# EAGLE design play (EAGLE 7.5.0)
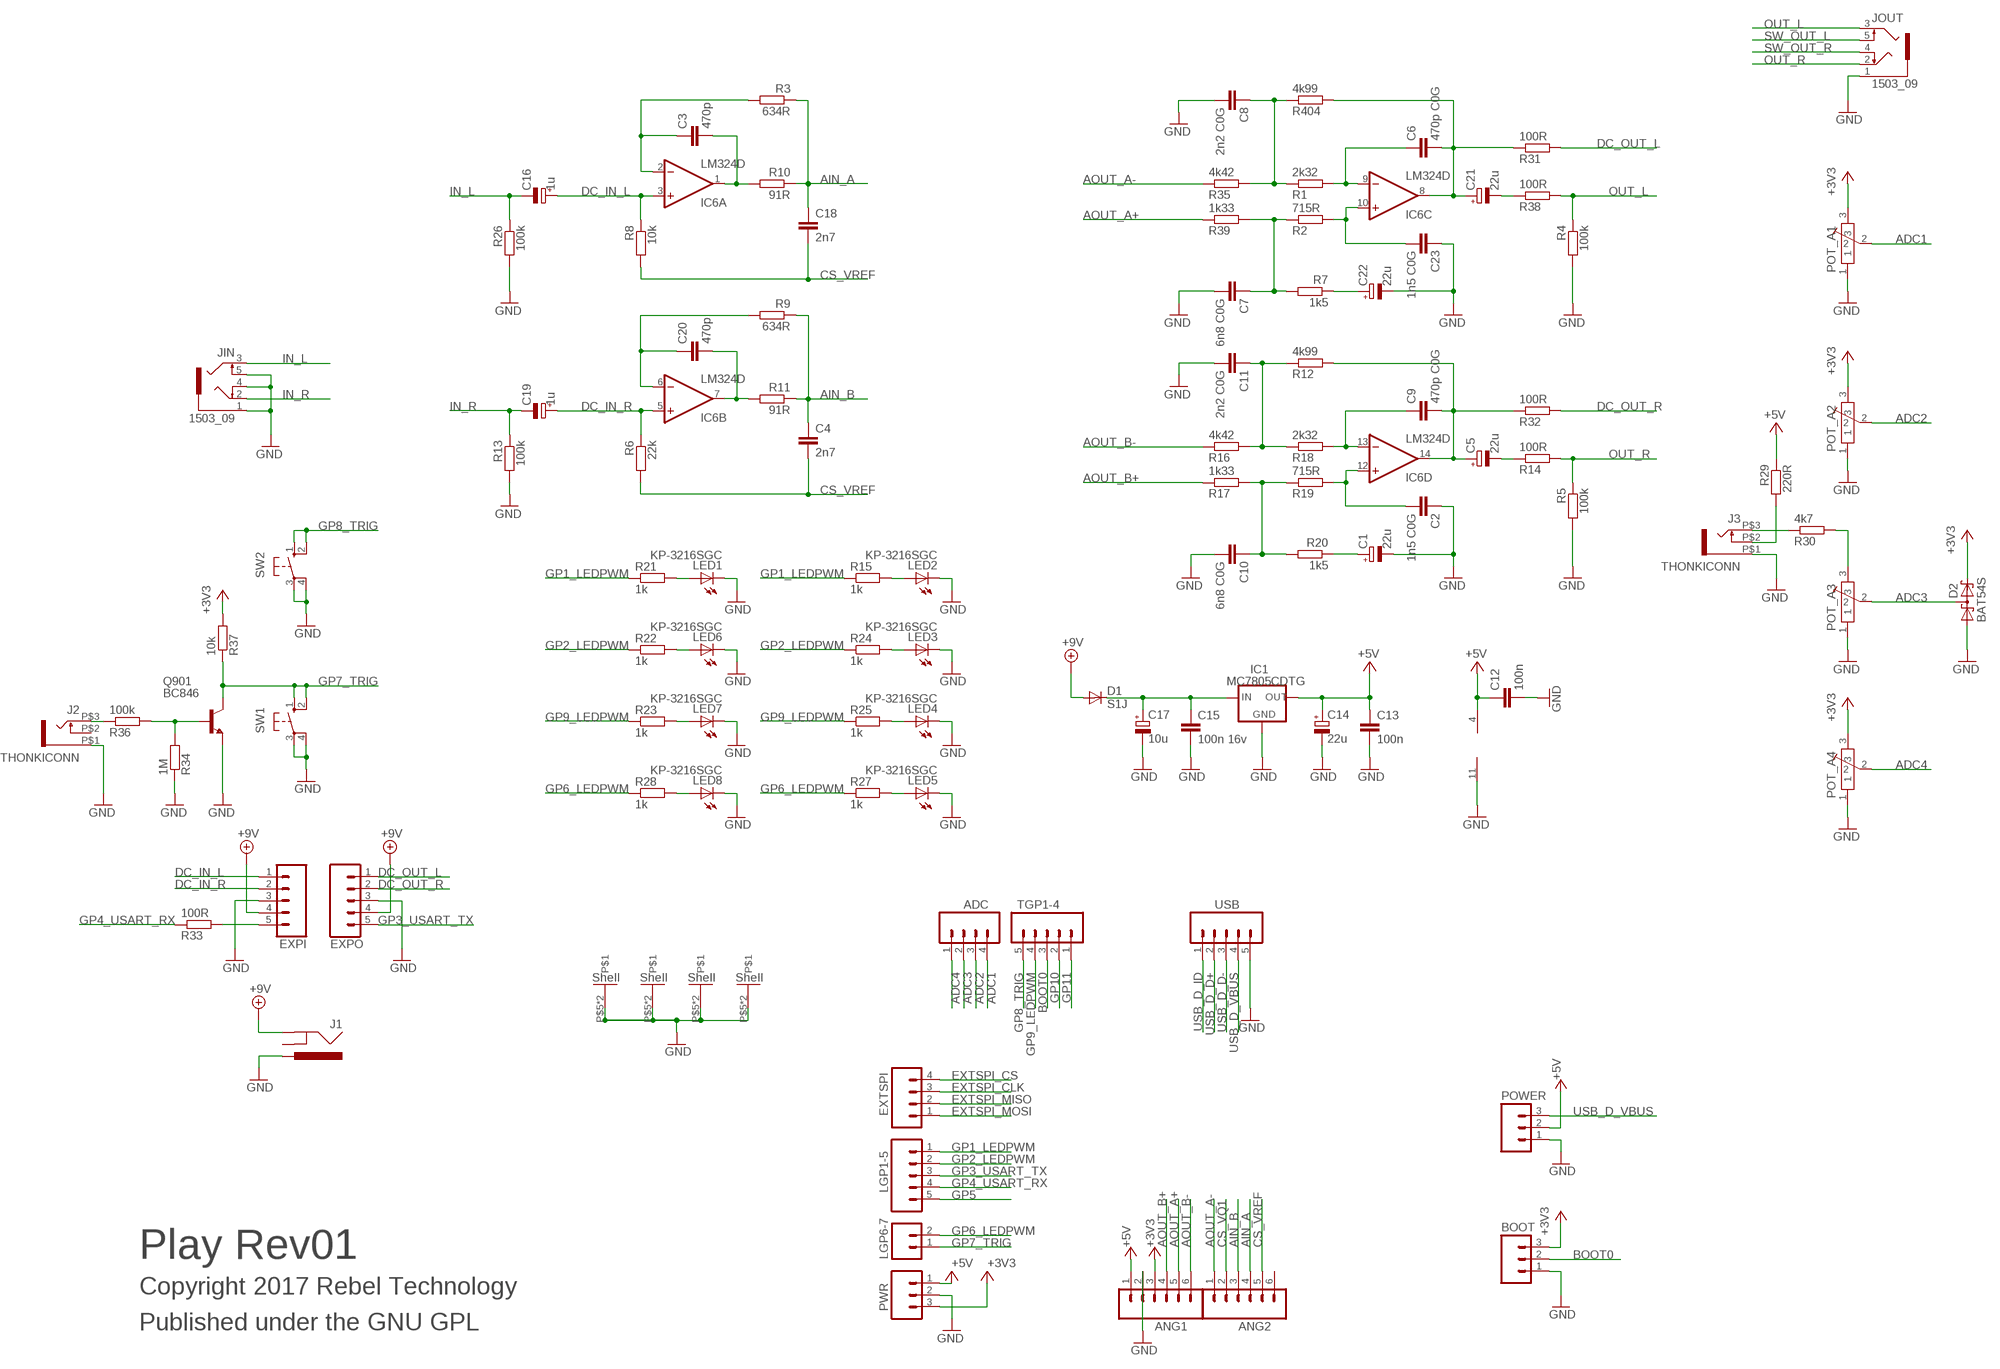
[diagram p0: schematic, sheet 1]

## Parts
ADC  M04PTH  [1X04]
ANG1  M06SIP  [1X06]
ANG2  M06SIP  [1X06]
BOOT  M03PTH  [1X03]
C1  22u  CPOL-EU153CLV-0505  [CPOL-5]
C2  1n5 C0G  C-EUC0603  [C0603]
C3  470p  C-EUC0603  [C0603]
C4  2n7  C-EUC0603  [C0603]
C5  22u  CPOL-EU153CLV-0505  [CPOL-5]
C6  470p C0G  C-EUC0603  [C0603]
C7  6n8 C0G  C-EUC0603  [C0603]
C8  2n2 C0G  C-EUC0603  [C0603]
C9  470p C0G  C-EUC0603  [C0603]
C10  6n8 C0G  C-EUC0603  [C0603]
C11  2n2 C0G  C-EUC0603  [C0603]
C12  100n  C-EUC0603  [C0603]
C13  100n  C-EUC0603  [C0603]
C14  22u  CPOL-EU153CLV-0505  [CPOL-5]
C15  100n 16v  C-EUC0603  [C0603]
C16  1u  CPOL-EU153CLV-0405  [153CLV-0405]
C17  10u  CPOL-EU153CLV-0405  [153CLV-0405]
C18  2n7  C-EUC0603  [C0603]
C19  1u  CPOL-EU153CLV-0405  [153CLV-0405]
C20  470p  C-EUC0603  [C0603]
C21  22u  CPOL-EU153CLV-0505  [CPOL-5]
C22  22u  CPOL-EU153CLV-0505  [CPOL-5]
C23  1n5 C0G  C-EUC0603  [C0603]
D1  S1J  DIODESMA  [SMA-DIODE]
D2  BAT54S  [SOT23]
EXPI  M05PTH  [1X05]
EXPO  M05PTH  [1X05]
EXTSPI  M04PTH  [1X04]
IC1  MC7805CDTG  MC78XX  [DPACK]
IC6  LM324D  [SO14]
J1  POWER_JACKPTH  [POWER_JACK_PTH]
J2  THONKICONN  [THONKICONN]
J3  THONKICONN  [THONKICONN]
JIN  1503_09  [1503_09]
JOUT  1503_09  [1503_09]
LED1  KP-3216SGC  LED1206  [LED-1206]
LED2  KP-3216SGC  LED1206  [LED-1206]
LED3  KP-3216SGC  LED1206  [LED-1206]
LED4  KP-3216SGC  LED1206  [LED-1206]
LED5  KP-3216SGC  LED1206  [LED-1206]
LED6  KP-3216SGC  LED1206  [LED-1206]
LED7  KP-3216SGC  LED1206  [LED-1206]
LED8  KP-3216SGC  LED1206  [LED-1206]
LGP1-5  M05PTH  [1X05]
LGP6-7  M02PTH  [1X02]
POT_A1  POT-ALPS-RK09L1140  [POT-ALPS-RK09L1140]
POT_A2  POT-ALPS-RK09L1140  [POT-ALPS-RK09L1140]
POT_A3  POT-ALPS-RK09L1140  [POT-ALPS-RK09L1140]
POT_A4  POT-ALPS-RK09L1140  [POT-ALPS-RK09L1140]
POWER  M03PTH  [1X03]
PWR  M03PTH  [1X03]
Q901  BC846  [SOT23]
R1  2k32  R-EU_0603  [0603]
R2  715R  R-EU_0603  [0603]
R3  634R  R-EU_0603  [0603]
R4  100k  R-EU_0603  [0603]
R5  100k  R-EU_0603  [0603]
R6  22k  R-EU_0603  [0603]
R7  1k5  R-EU_0603  [0603]
R8  10k  R-EU_0603  [0603]
R9  634R  R-EU_0603  [0603]
R10  91R  R-EU_0603  [0603]
R11  91R  R-EU_0603  [0603]
R12  4k99  R-EU_0603  [0603]
R13  100k  R-EU_0603  [0603]
R14  100R  R-EU_0603  [0603]
R15  1k  R-EU_0603  [0603]
R16  4k42  R-EU_0603  [0603]
R17  1k33  R-EU_0603  [0603]
R18  2k32  R-EU_0603  [0603]
R19  715R  R-EU_0603  [0603]
R20  1k5  R-EU_0603  [0603]
R21  1k  R-EU_0603  [0603]
R22  1k  R-EU_0603  [0603]
R23  1k  R-EU_0603  [0603]
R24  1k  R-EU_0603  [0603]
R25  1k  R-EU_0603  [0603]
R26  100k  R-EU_0603  [0603]
R27  1k  R-EU_0603  [0603]
R28  1k  R-EU_0603  [0603]
R29  220R  R-EU_0603  [0603]
R30  4k7  R-EU_0603  [0603]
R31  100R  R-EU_0603  [0603]
R32  100R  R-EU_0603  [0603]
R33  100R  R-EU_0603  [0603]
R34  1M  R-EU_0603  [0603]
R35  4k42  R-EU_0603  [0603]
R36  100k  R-EU_0603  [0603]
R37  10k  R-EU_0603  [0603]
R38  100R  R-EU_0603  [0603]
R39  1k33  R-EU_0603  [0603]
R404  4k99  R-EU_0603  [0603]
SW1  10-XX  [B3F-10XX]
SW2  10-XX  [B3F-10XX]
TGP1-4  M05PTH  [1X05]
USB  M05PTH  [1X05]

## Nets
+3V3: ANG1.3 BOOT.3 D2.2(C2) POT_A1.3 POT_A2.3 POT_A4.3 PWR.3 R37.2
+5V: ANG1.1 C12.1 C13.1 C14.+ IC1.3(OUT) IC6.4(P:V+) POWER.2 PWR.1 R29.1
+9V: D1.A EXPI.4 EXPO.4 J1.GND
ADC1: ADC.4 POT_A1.2
ADC2: ADC.3 POT_A2.2
ADC3: ADC.2 D2.3(C1A2) POT_A3.2
ADC4: ADC.1 POT_A4.2
AIN_A: ANG2.4 C18.1 R3.1 R10.1
AIN_B: ANG2.3 C4.1 R9.1 R11.1
AOUT_A+: ANG1.5 R39.1
AOUT_A-: ANG2.1 R35.1
AOUT_B+: ANG1.4 R17.1
AOUT_B-: ANG1.6 R16.1
BOOT0: BOOT.2 TGP1-4.3
CS_VQ1: ANG2.2
CS_VREF: ANG2.5 C4.2 C18.2 R6.2 R8.2
DC_IN_L: C16.+ EXPI.1 IC6.3(A:+IN) R8.1
DC_IN_R: C19.+ EXPI.2 IC6.5(B:+IN) R6.1
DC_OUT_L: EXPO.1 R31.2
DC_OUT_R: EXPO.2 R32.2
EXTSPI_CLK: EXTSPI.3
EXTSPI_CS: EXTSPI.4
EXTSPI_MISO: EXTSPI.2
EXTSPI_MOSI: EXTSPI.1
GND: ANG1.2 BOOT.1 C1.- C2.1 C7.2 C8.2 C10.2 C11.2 C12.2 C13.2 C14.- C15.2 C17.- C22.- C23.1 D2.1(A1) EXPI.3 EXPO.3 IC1.4(GND) IC6.11(P:V-) J1.PWR J2.P$1 J3.P$1 JIN.1 JIN.4 JIN.5 JOUT.1 LED1.C LED2.C LED3.C LED4.C LED5.C LED6.C LED7.C LED8.C POT_A1.1 POT_A1.P$5 POT_A1.P$6 POT_A2.1 POT_A2.P$5 POT_A2.P$6 POT_A3.1 POT_A3.P$5 POT_A3.P$6 POT_A4.1 POT_A4.P$5 POT_A4.P$6 POWER.1 PWR.2 Q901.2(E) R4.2 R5.2 R13.2 R26.2 R34.1 SW1.3(P) SW1.4(P1) SW2.3(P) SW2.4(P1) USB.5
GP1_LEDPWM: LGP1-5.1 R15.1 R21.1
GP2_LEDPWM: LGP1-5.2 R22.1 R24.1
GP3_USART_TX: EXPO.5 LGP1-5.3
GP4_USART_RX: LGP1-5.4 R33.1
GP5: LGP1-5.5
GP6_LEDPWM: LGP6-7.2 R27.1 R28.1
GP7_TRIG: LGP6-7.1 Q901.3(C) R37.1 SW1.1(S) SW1.2(S1)
GP8_TRIG: SW2.1(S) SW2.2(S1) TGP1-4.5
GP9_LEDPWM: R23.1 R25.1 TGP1-4.4
GP10: TGP1-4.2
GP11: TGP1-4.1
IN_L: C16.- JIN.3 R26.1
IN_R: C19.- JIN.2 R13.1
N$1: EXPI.5 R33.2
N$3: C3.1 IC6.2(A:-IN) R3.2
N$4: C20.2 IC6.7(B:OUT) R11.2
N$5: C20.1 IC6.6(B:-IN) R9.2
N$6: C3.2 IC6.1(A:OUT) R10.2
N$7: C6.1 IC6.9(C:-IN) R1.2
N$8: C1.+ R20.1
N$9: C21.- R38.1
N$10: C22.+ R7.1
N$11: C23.2 IC6.10(C:+IN) R2.2
N$12: C5.+ C9.2 IC6.14(D:OUT) R12.2 R32.1
N$13: C5.- R14.1
N$14: LED2.A R15.2
N$15: C7.1 R2.1 R7.2 R39.2
N$16: LED1.A R21.2
N$17: LED6.A R22.2
N$18: LED7.A R23.2
N$19: LED8.A R28.2
N$20: LED3.A R24.2
N$21: LED4.A R25.2
N$22: J2.P$3 R36.1
N$23: J3.P$2 R29.2
N$24: C11.1 R12.1 R16.2 R18.1
N$25: POT_A3.3 R30.2
N$26: C9.1 IC6.13(D:-IN) R18.2
N$27: J3.P$3 R30.1
N$28: LED5.A R27.2
N$29: C15.1 C17.+ D1.C IC1.1(IN)
N$30: C2.2 IC6.12(D:+IN) R19.2
N$32: C10.1 R17.2 R19.1 R20.2
N$37: Q901.1(B) R34.2 R36.2
N$39: C6.2 C21.+ IC6.8(C:OUT) R31.1 R404.2
N$41: C8.1 R1.1 R35.2 R404.1
OUT_L: JOUT.3 R4.1 R38.2
OUT_R: JOUT.2 R5.1 R14.2
SW_OUT_L: JOUT.5
SW_OUT_R: JOUT.4
USB_D_D+: USB.2
USB_D_D-: USB.3
USB_D_ID: USB.1
USB_D_VBUS: POWER.3 USB.4
Unconnected: ANG2.6 J1.GNDBREAK J2.P$2

## Notes on the sheet
- Play Rev01
- Copyright 2017 Rebel Technology
- Published under the GNU GPL

## Library data of the parts
ADC EXTSPI = SparkFun:M04: Header 4 Standard 4-pin 0.1" header. Use with straight break away headers (SKU : PRT-00116), right angle break away headers (PRT-00553), swiss pins (PRT-00743), machine pins (PRT-00117), and female headers (PRT-00115). Molex polarized connector foot print use with SKU : PRT-08231 with associated crimp pins and housings. 1MM SMD Version SKU: PRT-10208
ANG1 ANG2 = SparkFun:M06: Header 6 Standard 6-pin 0.1" header. Use with straight break away headers (SKU : PRT-00116), right angle break away headers (PRT-00553), swiss pins (PRT-00743), machine pins (PRT-00117), and female headers (PRT-00115). Molex polarized connector foot print use with SKU : PRT-08094 with associated crimp pins and housings. NOTES ON THE VARIANTS LOCK and LOCK_LONGPADS... This footprint was designed to help hold the alignment of a through-hole component (i.e. 6-pin header) while soldering it into place. You may notice that each hole has been shifted either up or down by 0.005 of an inch from it's more standard position (which is a perfectly straight line). This slight alteration caused the pins (the squares in the middle) to touch the edges of the holes. Because they are alternating, it causes a "brace" to hold the component in place. 0.005 has proven to be the perfect amount of "off-center" position when using our standard breakaway headers. Although looks a little odd when you look at the bare footprint, once you have a header in there, the alteration is very hard to notice. Also, if you push a header all the way into place, it is covered up entirely on the bottom side. This idea of altering the position of holes to aid alignment will be further integrated into the Sparkfun Library for other footprints. It can help hold any component with 3 or more connection pins.
BOOT POWER PWR = SparkFun:M03: Header 3 Standard 3-pin 0.1" header. Use with straight break away headers (SKU : PRT-00116), right angle break away headers (PRT-00553), swiss pins (PRT-00743), machine pins (PRT-00117), and female headers (PRT-00115). Molex polarized connector foot print use with SKU : PRT-08232 with associated crimp pins and housings.
C1 C5 C14 C16 C17 C19 C21 C22 = Rebel:CPOL-EU: POLARIZED CAPACITOR, European symbol
C2-C4 C6-C12 C18 C20 C23 = resistor:C-EU: CAPACITOR, European symbol
C13 C15 = Rebel:C-EU: CAPACITOR, European symbol
D1 = SparkFun:DIODE: Diode These are standard reverse protection diodes and small signal diodes. SMA package can handle up to about 1A. SOD-323 can handle about 200mA. What the SOD-323 package when ordering, there are some mfgs out there that are 5-pin packages.
D2 = diode:BAT54S: Schottky Diodes Pin connection corrected 2011-05-04 Source: Fairchild .. BAT54.pdf
EXPI EXPO LGP1-5 TGP1-4 USB = SparkFun:M05: Header 5 Standard 5-pin 0.1" header. Use with straight break away headers (SKU : PRT-00116), right angle break away headers (PRT-00553), swiss pins (PRT-00743), machine pins (PRT-00117), and female headers (PRT-00115). Molex polarized connector foot print use with SKU : PRT-08230 with associated crimp pins and housings.
IC1 = James:MC78XX: VOLTAGE REGULATOR; OC_FARNELL: 2296028
IC6 = linear:LM324: OP AMP
J1 = SparkFun:POWER_JACK: Power Jack This is the standard 5.5mm barrel jack for power. The PTH is the most common, proven, reliable, footprint. All others are experimental. The Slot footprint only works if the mill layer is transmitted to the PCB fab house so be warned. Spark Fun Electronics SKU : PRT-00119. Mating wall wart : TOL-00298 (and others)
J2 J3 = Rebel:THONKICONN
JIN JOUT = con-lumberg:1503_09: Jack connectors according to JISC 6560, 3.5 mm Klinkeneinbaukupplung nach JISC 6560, 3,5 mm, 3-polig/ stereo, abgewinkelte Ausführung, mit 2 Öffnern und Lötaugen, für Leiterplatten Rückseitenmontage Source: http://www.lumberg.com/Produkte/PDFs/1503_09.pdf; OC_FARNELL: 1243244; OC_NEWARK: unknown
LED1-LED8 = SparkFun:LED: LEDs Standard schematic elements and footprints for 5mm, 3mm, 1206, and 0603 sized LEDs. 5mm - Spark Fun Electronics SKU : COM-00529 (and others); FARNELL: 853-0033
LGP6-7 = SparkFun:M02: Header 2 Standard 2-pin 0.1" header. Use with straight break away headers (SKU : PRT-00116), right angle break away headers (PRT-00553), swiss pins (PRT-00743), machine pins (PRT-00117), and female headers (PRT-00115). Molex polarized connector foot print use with SKU : PRT-08233 with associated crimp pins and housings.
POT_A1-POT_A4 = Rebel:POT-ALPS-RK09L
Q901 = transistor:BC846: NPN TRANSISTOR
R1-R39 R404 = Rebel:R-EU_: RESISTOR, European symbol
SW1 SW2 = switch-omron:10-XX: OMRON SWITCH; MPN: B3F-1000; OC_FARNELL: 176432; OC_NEWARK: 36M3542

## Net classes
1 power: width 0.178 mm, drill 0.305 mm, clearance 0.178 mm to class 0, clearance 0.178 mm

## Board
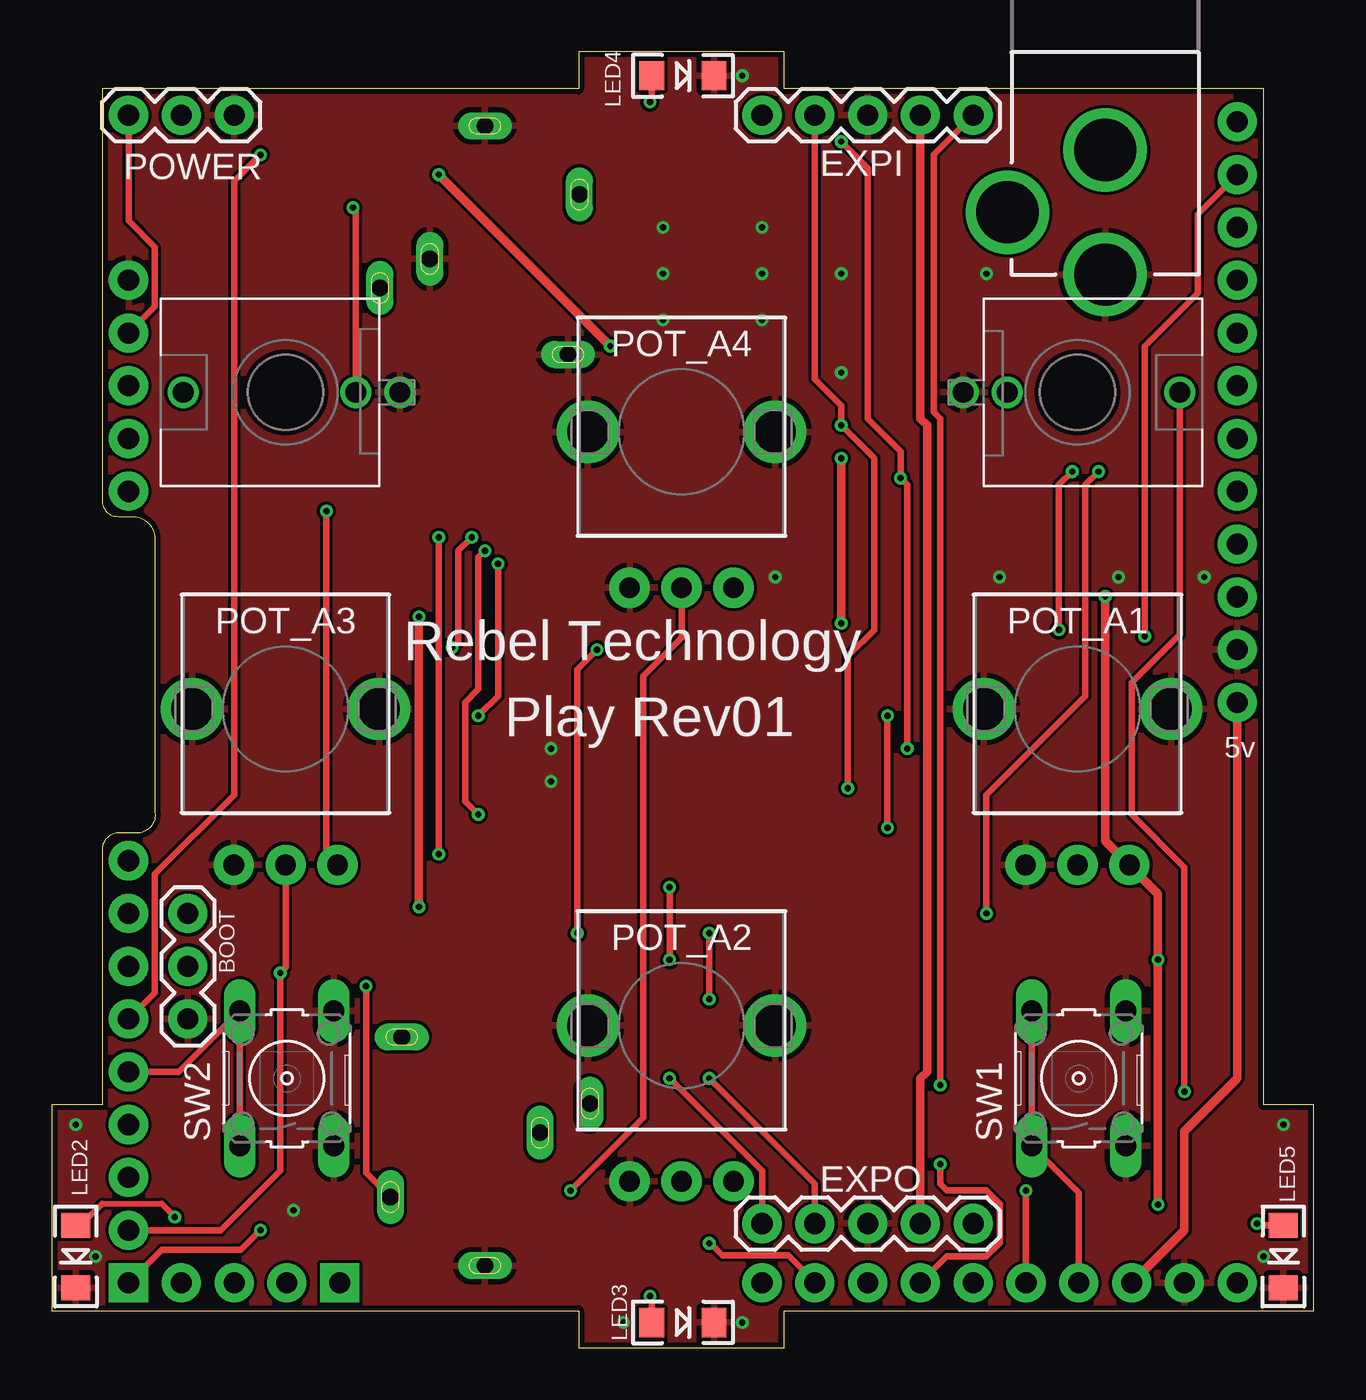
[diagram p1: board, top side]
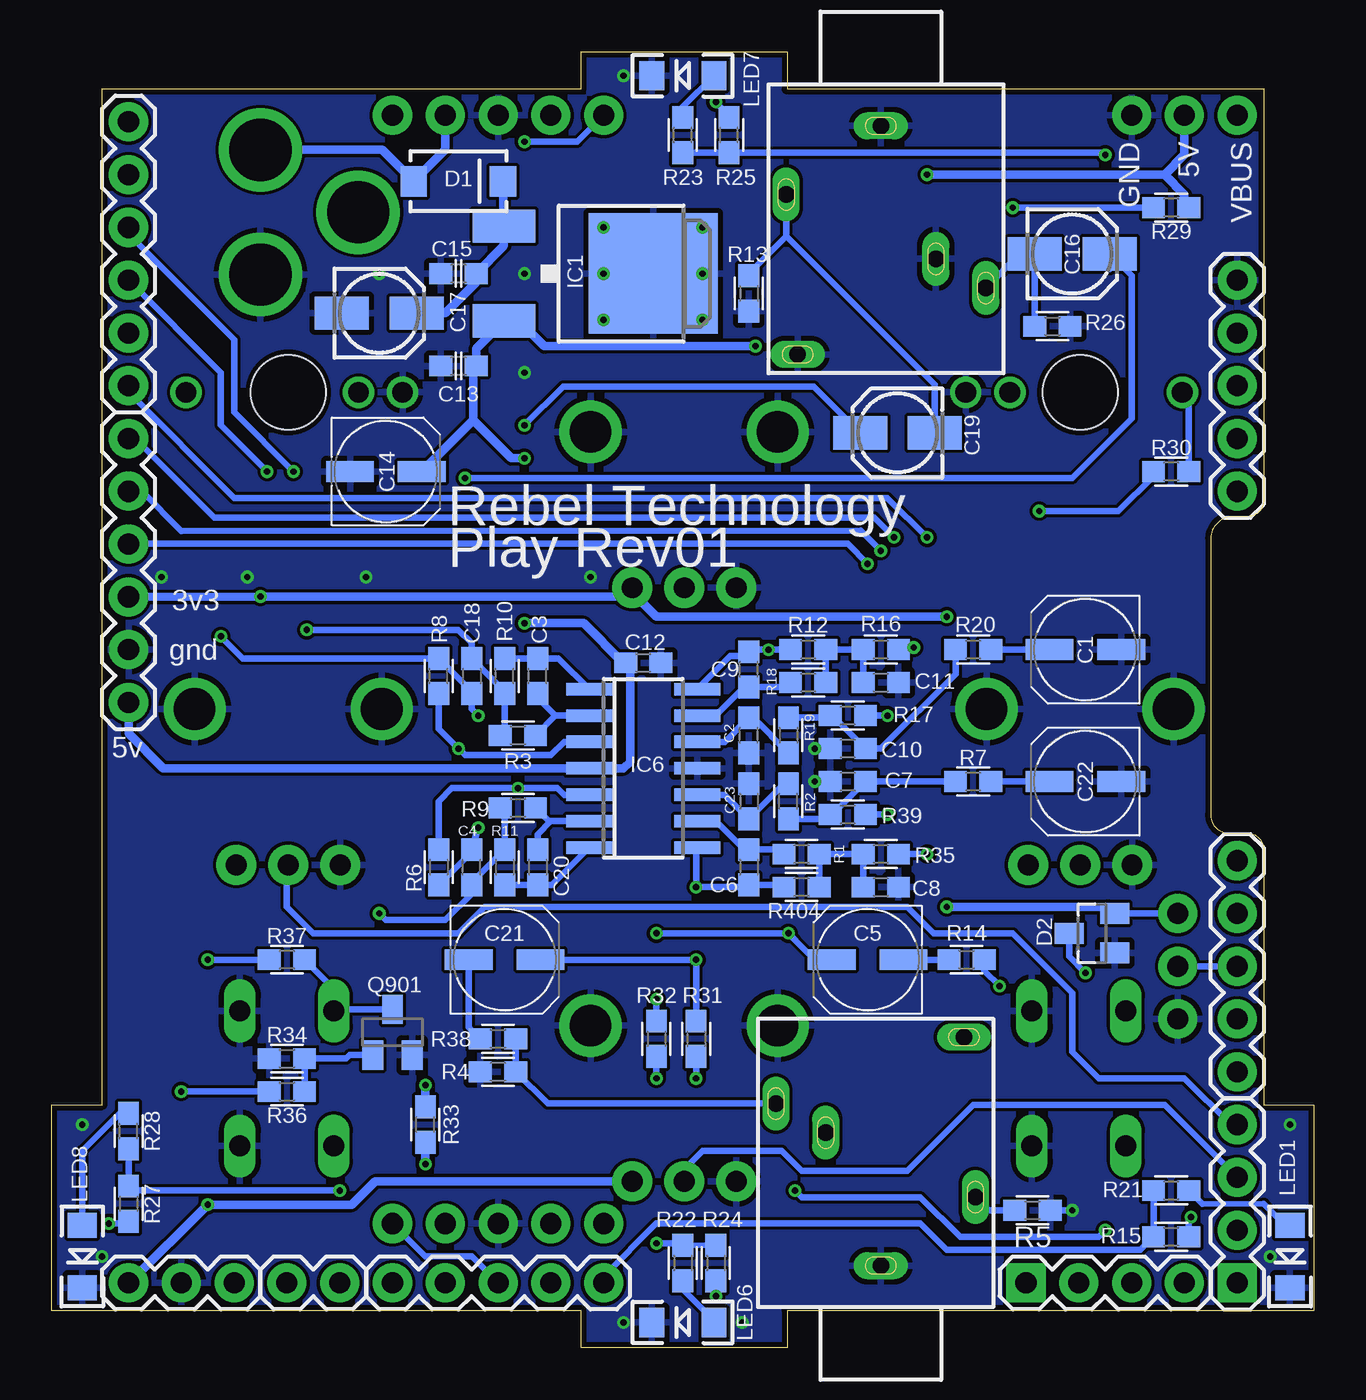
[diagram p2: board, bottom side, seen from below]

Size 60.71 x 62.36 mm. Coordinates in mm from the lower left corner, seen from the top.
Outline: 58.29,60.58 35.24,60.58 35.24,62.36 25.34,62.36 25.34,60.58 2.41,60.58 2.41,40.74 arc90 3.17,40.01 3.94,40.01 arc-90 4.95,38.84 4.95,25.74 arc-90 4.19,24.77 3.17,24.77 arc90 2.41,23.94 2.41,11.68 0,11.68 0,1.78 25.34,1.78 25.34,0 35.24,0 35.24,1.78 60.71,1.78 60.71,11.68 58.29,11.68 58.29,60.58
Copper layers (1*16): Top 0.035mm / dielectric 1.5mm / Bottom 0.035mm
Design rules "SeeedStudio_2layer_DRU_no_angle_20140221": minimum track width 6mil, minimum drill 12mil, track to track 6mil, track to pad 6mil, pad to pad 6mil, via to via 6mil, smd to smd 0mil, copper to edge 10mil, drill to drill 10mil, minimum pad ring 10mil, minimum via ring 6mil, stop-mask expansion 2mil, vias tented up to drill 100mil, thermal gap 10mil

### Footprints (pad centres in the part's own frame; a part is rotated, then mirrored left to right if it is on the bottom)
1X04 = drill 1.016 pad 1.88 square: 1 0,0 | drill 1.016 pad 1.88: 2 2.54,0; 3 5.08,0; 4 7.62,0
1X06 = drill 1.016 pad 1.88: 1 0,0; 2 2.54,0; 3 5.08,0; 4 7.62,0; 5 10.16,0; 6 12.7,0
1X03 = drill 1.016 pad 1.88: 1 0,0; 2 2.54,0; 3 5.08,0
CPOL-5 = smd 2.3 x 1: + 1.725,0; - -1.725,0
C0603 = smd 1.1 x 1: 1 -0.85,0; 2 0.85,0
153CLV-0405 = smd 2.6 x 1.6: + 1.8,0; - -1.8,0
SMA-DIODE = smd 1.27 x 1.47: A -2.15,0; C 2.15,0
SOT23 = smd 1 x 1.4: 1 -0.95,-1.1; 2 0.95,-1.1; 3 0,1.1
1X05 = drill 1.016 pad 1.88: 1 0,0; 2 2.54,0; 3 5.08,0; 4 7.62,0; 5 10.16,0
DPACK = smd 1.6 x 3: 1 -2.28,-4.8; 3 2.28,-4.8 | smd 5.8 x 6.2: 4 0,2.38
SO14 = smd 0.6 x 2.2: 1 -3.81,-2.6; 2 -2.54,-2.6; 3 -1.27,-2.6; 4 0,-2.6; 5 1.27,-2.6; 6 2.54,-2.6; 7 3.81,-2.6; 8 3.81,2.6; 9 2.54,2.6; 10 1.27,2.6; 11 0,2.6; 12 -1.27,2.6; 13 -2.54,2.6; 14 -3.81,2.6
POWER_JACK_PTH = drill 2.997: GND 0,7.7; GNDBREAK 4.7,10.7; PWR 0,13.7
THONKICONN = drill 1: P$1 0,-5.5; P$2 0,-3.38; P$3 0,4.92 | hole 3.6: 0,0
1503_09 = drill 0.8 pad 1.2 long: 1 0,-2.1; 2 -4.55,-5.4; 3 5.05,-9.9; 4 -4,-13.1; 5 2.65,-8.5
LED-1206 = smd 1.2 x 1.4: A -1.5,0; C 1.5,0
1X02 = drill 1.016 pad 1.88: 1 0,0; 2 2.54,0
POT-ALPS-RK09L1140 = drill 1 pad 1.93: 1 -2.5,-7.5; 2 0,-7.5; 3 2.5,-7.5 | drill 2: P$5 -4.5,0; P$6 4.5,0
0603 = smd 1.1 x 1: 1 -0.85,0; 2 0.85,0
B3F-10XX = drill 1.016 long: 1 -3.251,2.261; 2 3.251,2.261; 3 -3.251,-2.261; 4 3.251,-2.261

### Placement (x,y rotation side)
ADC  3.68,3.11 90 bottom
ANG1  57.02,31.05 90 bottom
ANG2  57.02,46.29 90 bottom
BOOT  6.54,15.81 90 top
C1  10.99,33.59 180 bottom
C2  27.18,29.46 90 bottom
C3  37.34,32.32 90 bottom
C4  40.51,23.11 90 bottom
C5  21.46,18.67 180 bottom
C6  27.18,23.11 270 bottom
C7  22.42,27.24 180 bottom
C8  20.83,22.16 0 bottom
C9  27.18,32.64 90 bottom
C10  22.42,28.83 180 bottom
C11  20.83,32 0 bottom
C12  32.26,32.96 0 bottom
C13  41.15,47.24 180 bottom
C14  44.64,42.16 0 bottom
C15  41.15,51.69 180 bottom
C16  11.62,52.64 0 bottom
C17  44.96,49.78 0 bottom
C18  40.51,32.32 270 bottom
C19  20.03,44.02 180 bottom
C20  37.34,23.11 270 bottom
C21  38.93,18.67 0 bottom
C22  10.99,27.24 180 bottom
C23  27.18,26.29 270 bottom
D1  41.15,56.13 0 bottom
D2  10.67,19.94 90 bottom
EXPI  34.16,59.31 0 top
EXPO  34.16,5.97 0 top
EXTSPI  13.84,3.11 0 bottom
IC1  34.16,51.69 270 bottom
IC6  32.26,27.88 270 bottom
J1  50.67,65.34 180 top
J2  49.34,45.97 270 top
J3  11.24,45.97 90 top
JIN  20.83,60.9 0 bottom
JOUT  20.83,1.84 180 bottom
LED1  1.14,4.38 270 bottom
LED2  1.14,4.38 270 top
LED3  30.35,1.21 0 top
LED4  30.35,61.21 0 top
LED5  59.25,4.38 270 top
LED6  30.35,1.21 180 bottom
LED7  30.35,61.21 180 bottom
LED8  59.25,4.38 270 bottom
LGP1-5  34.16,3.11 180 bottom
LGP6-7  49.4,3.11 0 bottom
POT_A1  49.34,30.73 0 top
POT_A2  30.29,15.49 0 top
POT_A3  11.24,30.73 0 top
POT_A4  30.29,44.07 0 top
POWER  8.76,59.31 180 top
PWR  51.94,3.11 180 bottom
Q901  44.32,15.18 0 bottom
R1  24.64,23.75 180 bottom
R2  25.27,26.29 90 bottom
R3  38.29,29.46 0 bottom
R4  39.24,13.27 180 bottom
R5  13.53,6.6 0 bottom
R6  42.1,23.11 270 bottom
R7  16.38,27.24 180 bottom
R8  42.1,32.32 90 bottom
R9  38.29,25.97 0 bottom
R10  38.93,32.32 90 bottom
R11  38.93,23.11 270 bottom
R12  24.32,33.59 180 bottom
R13  27.18,50.74 270 bottom
R14  16.7,18.67 0 bottom
R15  6.86,5.33 0 bottom
R16  20.83,33.59 180 bottom
R17  22.42,30.42 180 bottom
R18  24.32,32 180 bottom
R19  25.27,29.46 270 bottom
R20  16.38,33.59 180 bottom
R21  6.86,7.56 0 bottom
R22  30.35,4.06 270 bottom
R23  30.35,58.36 90 bottom
R24  28.77,4.06 270 bottom
R25  28.13,58.36 90 bottom
R26  12.57,49.15 0 bottom
R27  57.02,6.92 270 bottom
R28  57.02,10.41 90 bottom
R29  6.86,54.86 180 bottom
R30  6.86,42.16 180 bottom
R31  29.72,14.86 270 bottom
R32  31.62,14.86 270 bottom
R33  42.74,10.73 90 bottom
R34  49.4,13.91 0 bottom
R35  20.83,23.75 180 bottom
R36  49.4,12.32 0 bottom
R37  49.4,18.67 180 bottom
R38  39.24,14.86 0 bottom
R39  22.42,25.65 180 bottom
R404  24.64,22.16 180 bottom
SW1  49.4,12.95 90 top
SW2  11.3,12.95 90 top
TGP1-4  3.68,23.43 270 bottom
USB  3.68,41.21 90 bottom

### Tracks (layer width: path | path; a pad name or v marks a point on that pad's centre or on a via)
+3V3  (via drill 0.3)
  Top 0.406: v50.67,36.14 50.67,24.38 51.82,23.23 POT_A1.3 51.84,23.22 53.21,21.84 v53.21,18.67 v53.21,6.87 | v17.65,35.18 v17.65,21.21
  Bottom 0.305: BOOT.3 D2.2 | R37.2 v53.21,18.67
  Bottom 0.406: ANG1.3 v50.67,36.14 33.21,36.14 POT_A4.3 32.79,36.35 31.62,35.18 v17.65,35.18 | v17.65,21.21 9.89,21.21 D2.2 | POT_A2.3 45.15,7.99 46.28,6.87 v53.21,6.87 56.97,3.11 PWR.3
+5V  (via drill 0.3)
  Top 0.406: v37.97,34.86 v37.97,42.8 | v18.61,56.45 v26.86,48.2 | PWR.1 54.48,5.65 54.48,10.41 57.02,12.95 ANG1.1
  Bottom 0.305: 6.22,55.08 R29.1
  Bottom 0.406: 40.44,44.64 C14.+ | v37.97,34.86 35.11,34.86 33.21,32.96 C12.1 32.89,32.74 32.89,28.19 33.21,27.88 IC6.4 55.34,27.88 57.02,29.56 ANG1.1 | v37.97,42.8 38.61,42.8 40.44,44.64 | 40.44,44.64 40.44,47.1 C13.1 40.3,48.07 IC1.3 38.59,49.78 37.02,48.2 v26.86,48.2 | v18.61,56.45 7.18,56.45 | 6.22,55.08 6.22,55.5 7.18,56.45 | POWER.2 6.22,57.4 7.18,56.45
+9V
  Top 0.406: EXPO.4 41.78,12.95 42.1,13.27 42.1,44.39 41.78,44.7 EXPI.4
  Bottom 0.406: J1.GND 44.8,57.64 D1.A 41.78,57.65 EXPI.4
ADC1
  Bottom 0.305: POT_A1.2 49.4,23.17 49.4,21.21 48.13,19.94 41.15,19.94 39.88,21.21 19.56,21.21 18.29,19.94 14.48,19.94 11.62,17.08 11.62,14.22 10.35,12.95 6.22,12.95 4,10.73 ADC.4
ADC2
  Bottom 0.305: POT_A2.2 30.29,8.57 29.4,9.46 25.59,9.46 24.64,8.51 19.56,8.51 16.38,11.68 7.18,11.68 ADC.3
ADC3  (via drill 0.3)
  Top 0.305: 3.64,5.65 ADC.2 8.13,5.65 10.99,8.51 v10.99,18.03 11.24,18.29 POT_A3.2
  Bottom 0.305: D2.3 11.77,18.82 v10.99,18.03
ADC4  (via drill 0.3)
  Top 0.305: ADC.1 5.27,4.7 9.08,4.7 v10.03,5.65 | POT_A4.2 30.29,34.16 28.45,32.32 28.45,11.05 v24.96,7.56
  Bottom 0.305: v10.03,5.65 10.35,5.33 17.02,5.33 18.92,7.24 24.64,7.24 v24.96,7.56
AIN_A  (via drill 0.3)
  Top 0.305: v48.45,34.54 48.45,41.53 v49.09,42.16
  Bottom 0.305: R3.1 38.93,29.68 R10.1 38.93,31.58 C18.1 40.51,33.91 41.15,34.54 v48.45,34.54 | v49.09,42.16 51.94,45.02 51.94,48.51 57.02,53.59 ANG2.4
AIN_B  (via drill 0.3)
  Top 0.305: v44.96,20.89 44.96,26.61 49.72,31.37 49.72,41.53 v50.36,42.16
  Bottom 0.305: R11.1 38.93,23.85 | R11.1 38.93,25.76 R9.1 | v44.96,20.89 44.64,20.57 41.78,20.57 40.51,21.84 C4.1 40.51,22.38 R11.1 | v50.36,42.16 52.58,44.39 52.58,46.93 ANG2.3
AOUT_A+  (via drill 0.3)
  Top 0.305: v20.83,38.35 20.51,38.04 20.51,31.69 19.88,31.05 19.88,26.29 v20.51,25.65
  Bottom 0.305: R39.1 v20.51,25.65 | v20.83,38.35 21.79,39.32 54.48,39.31 56.39,41.21 ANG1.5
AOUT_A-  (via drill 0.3)
  Top 0.305: v18.61,38.99 v18.61,23.75
  Bottom 0.305: v18.61,38.99 20.51,40.89 51.94,40.89 57.02,45.97 ANG2.1 | v18.61,23.75 R35.1
AOUT_B+  (via drill 0.3)
  Top 0.305: v21.46,37.72 21.46,31.37 v20.51,30.42
  Bottom 0.305: R17.1 v20.51,30.42 | v21.46,37.72 22.43,38.68 57.01,38.68 ANG1.4
AOUT_B-  (via drill 0.3)
  Top 0.305: v20.19,38.99 19.56,38.35 19.56,33.91 v19.24,33.69
  Bottom 0.305: v20.19,38.99 21.15,39.94 52.9,39.94 56.71,43.75 ANG1.6 | v19.24,33.69 R16.1
BOOT0
  Bottom 0.305: TGP1-4.3 BOOT.2
CS_VREF  (via drill 0.3)
  Top 0.305: v52.58,34.23 52.58,48.2 55.12,50.74 55.12,54.55 ANG2.5 | v40.2,25.02 v40.2,30.42
  Bottom 0.305: R6.2 40.51,23.85 C4.2 v40.2,25.02 | v52.58,34.23 51.52,33.17 R8.2 40.51,31.58 C18.2 40.51,30.73 v40.2,30.42
DC_IN_L  (via drill 0.3)
  Top 0.305: v41.15,28.83 41.15,41.53 v40.83,41.85 40.83,43.12 39.24,44.7 39.24,56.77 v37.97,58.04
  Bottom 0.305: IC6.3 36.07,29.15 36.7,28.51 40.83,28.51 v41.15,28.83 42.1,29.78 R8.1 | 9.82,51.9 C16.+ 8.76,51.58 8.76,44.7 11.62,41.85 v40.83,41.85 | v37.97,58.04 35.43,58.04 EXPI.1
DC_IN_R  (via drill 0.3)
  Top 0.305: v38.29,26.92 38.29,33.27 39.56,34.54 39.56,42.8 v37.97,44.39 37.97,45.34 36.7,46.61 EXPI.2
  Bottom 0.305: IC6.5 36.07,26.61 36.39,26.92 v38.29,26.92 41.47,26.92 42.1,26.29 R6.1 | v37.97,44.39 36.12,46.24 24.05,46.24 C19.+
DC_OUT_L  (via drill 0.3)
  Top 0.305: v29.72,12.95 34.16,8.51 EXPO.1
  Bottom 0.305: R31.2 v29.72,12.95
DC_OUT_R  (via drill 0.3)
  Top 0.305: EXPO.2 36.7,7.87 v31.62,12.95
  Bottom 0.305: R32.2 v31.62,12.95
GND  (via drill 0.3)
  Bottom 0.305: C10.2 v24,28.83 | C7.2 v24,27.24 | R5.2 v11.62,6.6
  other vias: 58.29,4.38 2.1,4.38 29.4,51.69 34.16,51.69 29.4,53.91 34.16,53.91 34.16,49.47 29.4,49.47 37.97,51.69 44.96,51.69 33.21,1.21 27.5,1.21 59.25,10.73 1.14,10.73 33.21,61.21 34.8,37.08 45.59,37.08 51.31,37.08 55.44,37.08 37.97,46.93
  pour Bottom: -9.02,-1.02 -9.02,65.02 62.1,65.02 62.1,-1.02
  pour Top: -7.75,-2.29 -7.75,63.75 63.37,63.75 63.37,-2.29
GP1_LEDPWM
  Bottom 0.305: R21.1 R15.1 8.34,4.7 17.65,4.7 18.92,5.97 31.62,5.97 34.16,3.43 LGP1-5.1
GP2_LEDPWM  (via drill 0.3)
  Top 0.305: v31.62,5.02 31.69,5.02 32.26,4.44 35.43,4.44 36.7,3.17 LGP1-5.2
  Bottom 0.254: R24.1 R22.1
  Bottom 0.305: v31.62,5.02 30.46,5.02 R22.1
GP3_USART_TX
  Bottom 0.305: LGP1-5.3 40.51,4.38 42.73,4.38 EXPO.5
GP4_USART_RX  (via drill 0.3)
  Top 0.305: 41.82,3.15 LGP1-5.4 43.05,4.38 44.96,4.38 45.59,5.02 45.59,6.92 44.96,7.56 43.05,7.56 42.73,7.87 v42.73,8.83
  Bottom 0.406: R33.1 v42.73,8.83
GP6_LEDPWM  (via drill 0.3)
  Top 0.305: LGP6-7.2 v46.86,7.56
  Bottom 0.305: v46.86,7.56 56.81,7.56 R27.1 R28.1
GP7_TRIG
  Top 0.305: SW1.2 SW1.1 49.4,7.44 LGP6-7.1
  Bottom 0.305: R37.1 47.14,17.26 SW1.2 47.07,16.28 Q901.3
GP8_TRIG
  Top 0.305: SW2.1 SW2.2 6.11,13.27 TGP1-4.5
GP9_LEDPWM  (via drill 0.3)
  Top 0.305: v10.03,57.4 8.76,56.13 8.76,26.61 4.95,22.8 4.95,17.08 TGP1-4.4
  Bottom 0.305: R23.1 R25.1 10.13,57.51 v10.03,57.4
IN_L
  Bottom 0.305: R26.1 13.42,52 C16.- 14.13,52.64 JIN.3
IN_R
  Bottom 0.305: JIN.2 25.38,53.49 | R13.1 27.18,51.69 25.38,53.49 | C19.- 18.23,46.34 25.38,53.49
N$1  (via drill 0.3)
  Top 0.305: v42.73,12.64 42.73,44.7 42.42,45.02 42.42,57.4 EXPI.5
  Bottom 0.406: R33.2 v42.73,12.64
N$3
  Bottom 0.305: IC6.2 36.49,30.42 | 36.49,30.42 R3.2 | C3.1 37.34,31.27 36.49,30.42
N$4
  Bottom 0.305: IC6.7 36.66,22.26 C20.2 R11.2
N$5
  Bottom 0.305: IC6.6 36.7,25.34 | 36.7,25.34 36.8,25.34 R9.2 | C20.1 37.34,24.7 36.7,25.34
N$6
  Bottom 0.305: IC6.1 36.34,33.17 C3.2 R10.2
N$7
  Bottom 0.305: R1.2 25.7,23.96 C6.1 27.39,23.75 27.39,23.96 28.77,25.34 IC6.9
N$8
  Bottom 0.305: R20.1 C1.+
N$9
  Bottom 0.305: C21.- 40.65,15.42 R38.1
N$10
  Bottom 0.305: C22.+ R7.1
N$11
  Bottom 0.305: R2.2 25.48,27.14 C23.2 28.35,26.61 IC6.10
N$12  (via drill 0.3)
  Top 0.305: v25.27,19.94 25.27,32.64 v26.23,33.59 | v31.62,19.94 v31.62,16.76
  Bottom 0.305: 24.96,19.62 v25.27,19.94 | 25.27,33.69 R12.2 v26.23,33.59 27.08,33.59 C9.2 27.39,33.27 28.07,33.27 IC6.14 | C5.+ 24,18.67 v25.27,19.94 | v25.27,19.94 v31.62,19.94 | v31.62,16.76 R32.1
N$13
  Bottom 0.305: C5.- R14.1
N$14  (via drill 0.3)
  Top 0.254: 2.41,6.92 5.27,6.92
  Top 0.305: LED2.A 1.37,5.88 2.41,6.92 | 5.27,6.92 v5.91,6.29
  Bottom 0.305: R15.2 6.01,6.18 v5.91,6.29
N$15
  Bottom 0.305: R2.1 23.48,25.44 R39.2 23.15,25.65 C7.1 R7.2
N$16
  Bottom 0.254: 2.41,6.92 5.37,6.92
  Bottom 0.305: LED1.A 1.37,5.88 2.41,6.92 | R21.2 5.37,6.92
N$17
  Bottom 0.305: LED6.A 28.85,1.29 30.35,2.79 R22.2
N$18
  Bottom 0.305: R23.2 30.35,59.71 LED7.A
N$19
  Bottom 0.305: LED8.A 59.25,9.46 57.44,11.26 R28.2
N$20  (via drill 0.3)
  Top 0.305: LED3.A 28.85,2.39 v28.77,2.48
  Bottom 0.305: v28.77,2.48 R24.2
N$21  (via drill 0.3)
  Top 0.305: LED4.A 28.85,60.03 v28.77,59.94
  Bottom 0.305: R25.2 28.13,59.31 v28.77,59.94
N$22  (via drill 0.3)
  Top 0.305: J2.P$3 54.26,34.32 51.94,32 51.94,25.65 54.48,23.11 v54.48,12.32
  Bottom 0.305: v54.48,12.32 R36.1
N$23  (via drill 0.3)
  Top 0.305: J3.P$2 14.62,54.72 v14.48,54.86
  Bottom 0.305: v14.48,54.86 R29.2
N$24
  Bottom 0.305: R18.1 R12.1 R16.2 C11.1
N$25  (via drill 0.3)
  Top 0.305: v13.21,40.26 13.21,23.77 POT_A3.3
  Bottom 0.305: R30.2 7.71,41.95 9.4,40.26 v13.21,40.26
N$26
  Bottom 0.305: R18.2 25.39,31.79 C9.1 27.39,32 27.39,31.79 28.77,30.42 IC6.13
N$27
  Bottom 0.305: R30.1 6.01,45.66 J3.P$3
N$28  (via drill 0.3)
  Top 0.305: LED5.A 58.06,5.88 v57.97,5.97
  Bottom 0.305: v57.97,5.97 57.12,5.97 R27.2
N$29
  Bottom 0.406: D1.C 39,54 IC1.1 38.96,53.02 C15.1 40.3,51.27 41.78,49.78 C17.+
N$30
  Bottom 0.305: R19.2 26.97,30.31 C2.2 28.35,29.15 IC6.12
N$32
  Bottom 0.305: R20.2 17.23,32.42 20.83,28.83 C10.1 23.15,30.42 R17.2 23.37,30.31 R19.1
N$37
  Bottom 0.305: R36.2 R34.2 46.54,13.91 46.38,14.08 Q901.1
N$39  (via drill 0.3)
  Top 0.305: v29.72,18.67 v29.72,22.16
  Bottom 0.305: R404.2 25.59,22.26 C6.2 27.28,22.16 v29.72,22.16 29.72,24.01 IC6.8 28.98,24.07 | C21.+ v29.72,18.67 R31.1
N$41
  Bottom 0.305: R404.1 R1.1 R35.2 C8.1
OUT_L
  Bottom 0.305: JOUT.3 36.86,11.74 R4.1 R38.2
OUT_R  (via drill 0.3)
  Top 0.305: v15.11,17.4 15.11,8.41 JOUT.2
  Bottom 0.305: R5.1 15.64,6.6 JOUT.2 | R14.2 15.85,18.14 v15.11,17.4
USB_D_VBUS
  Top 0.305: POWER.3 3.68,54.23 4.95,52.96 4.95,50.1 USB.4

### Text on the board
tPlace: Rebel Technology | Play Rev01 | 5v
bPlace: VBUS | 5V | GND | Rebel Technology | Play Rev01 | 3v3 | gnd | 5v